# Altium schematic sheet 09_MSM8916_MIPI.SchDoc
size A4
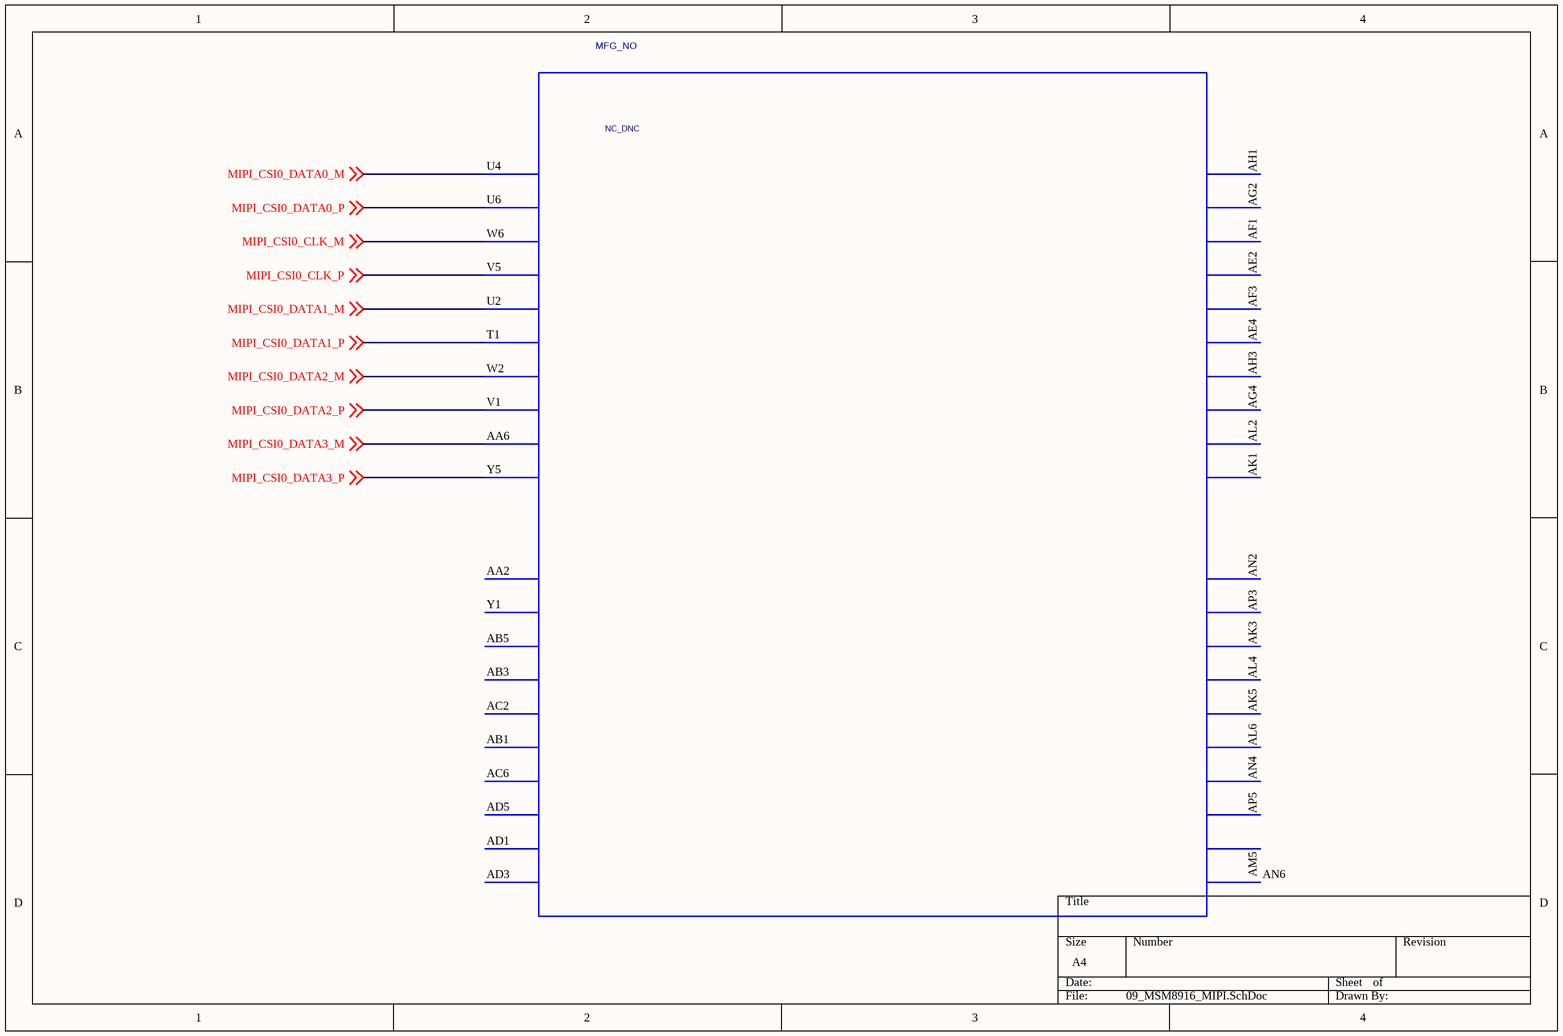
[diagram p0: 09_MSM8916_MIPI.SchDoc]

## Parts
U1  SYMNAME: NC_DNC  PART_ID: MFG_NO  [MSM-8916-0-760NSP-TR-00-0]  (hidden comment: ASIC_MSM8936_760PIN)  (part E of 13)

## Nets
MIPI_CSI0_CLK_M: U1.W6(MIPI_CSI0_LANE1N) ; off-sheet MIPI_CSI0_CLK_M
MIPI_CSI0_CLK_P: U1.V5(MIPI_CSI0_LANE1P) ; off-sheet MIPI_CSI0_CLK_P
MIPI_CSI0_DATA0_M: U1.U4(MIPI_CSI0_LANE0N) ; off-sheet MIPI_CSI0_DATA0_M
MIPI_CSI0_DATA0_P: U1.U6(MIPI_CSI0_LANE0P) ; off-sheet MIPI_CSI0_DATA0_P
MIPI_CSI0_DATA1_M: U1.U2(MIPI_CSI0_LANE2N) ; off-sheet MIPI_CSI0_DATA1_M
MIPI_CSI0_DATA1_P: U1.T1(MIPI_CSI0_LANE2P) ; off-sheet MIPI_CSI0_DATA1_P
MIPI_CSI0_DATA2_M: U1.W2(MIPI_CSI0_LANE3N) ; off-sheet MIPI_CSI0_DATA2_M
MIPI_CSI0_DATA2_P: U1.V1(MIPI_CSI0_LANE3P) ; off-sheet MIPI_CSI0_DATA2_P
MIPI_CSI0_DATA3_M: U1.AA6(MIPI_CSI0_LANE4N) ; off-sheet MIPI_CSI0_DATA3_M
MIPI_CSI0_DATA3_P: U1.Y5(MIPI_CSI0_LANE4P) ; off-sheet MIPI_CSI0_DATA3_P

Not connected (* = marked no-connect by the designer): U1 AA2(MIPI_CSI1_LANE0N) AB1(MIPI_CSI1_LANE2P) AB3(MIPI_CSI1_LANE1P) AB5(MIPI_CSI1_LANE1N) AC2(MIPI_CSI1_LANE2N) AC6(MIPI_CSI1_LANE3N) AD1(MIPI_CSI1_LANE4N) AD3(MIPI_CSI1_LANE4P) AD5(MIPI_CSI1_LANE3P) AE2(MIPI_DSI0_LANE0P) AE4(MIPI_DSI0_LANE1P) AF1(MIPI_DSI0_LANE0N) AF3(MIPI_DSI0_LANE1N) AG2(MIPI_DSI0_CLKP) AG4(MIPI_DSI0_LANE2P) AH1(MIPI_DSI0_CLKN) AH3(MIPI_DSI0_LANE2N) AK1(MIPI_DSI0_LANE3P) AK3(MIPI_DSI1_LANE0N) AK5(MIPI_DSI1_LANE1N) AL2(MIPI_DSI0_LANE3N) AL4(MIPI_DSI1_LANE0P) AL6(MIPI_DSI1_LANE1P) AM5(MIPI_DSI1_LANE3N) AN2(MIPI_DSI1_CLKN) AN4(MIPI_DSI1_LANE2N) AN6(MIPI_DSI1_LANE3P) AP3(MIPI_DSI1_CLKP) AP5(MIPI_DSI1_LANE2P) Y1(MIPI_CSI1_LANE0P)

## Library data of the parts
U1 = ASIC_MSM8936_760PIN: PART_NUMBER: MCN_NO; OriginalSymbolOrigin: (-1100,2500); SPLIT_INST: TRUE; CDS_LMAN_SYM_OUTLINE: -1050,2500,1050,-2500; CDS_LMAN_SPLIT_NUMBER: 1 of 13; PACK_TYPE: ?